# EAGLE design SparkFun_QwiicBus-Midpoint (EAGLE 9.6.0)
ABBREV: hb1; PROJECT: Heading Board
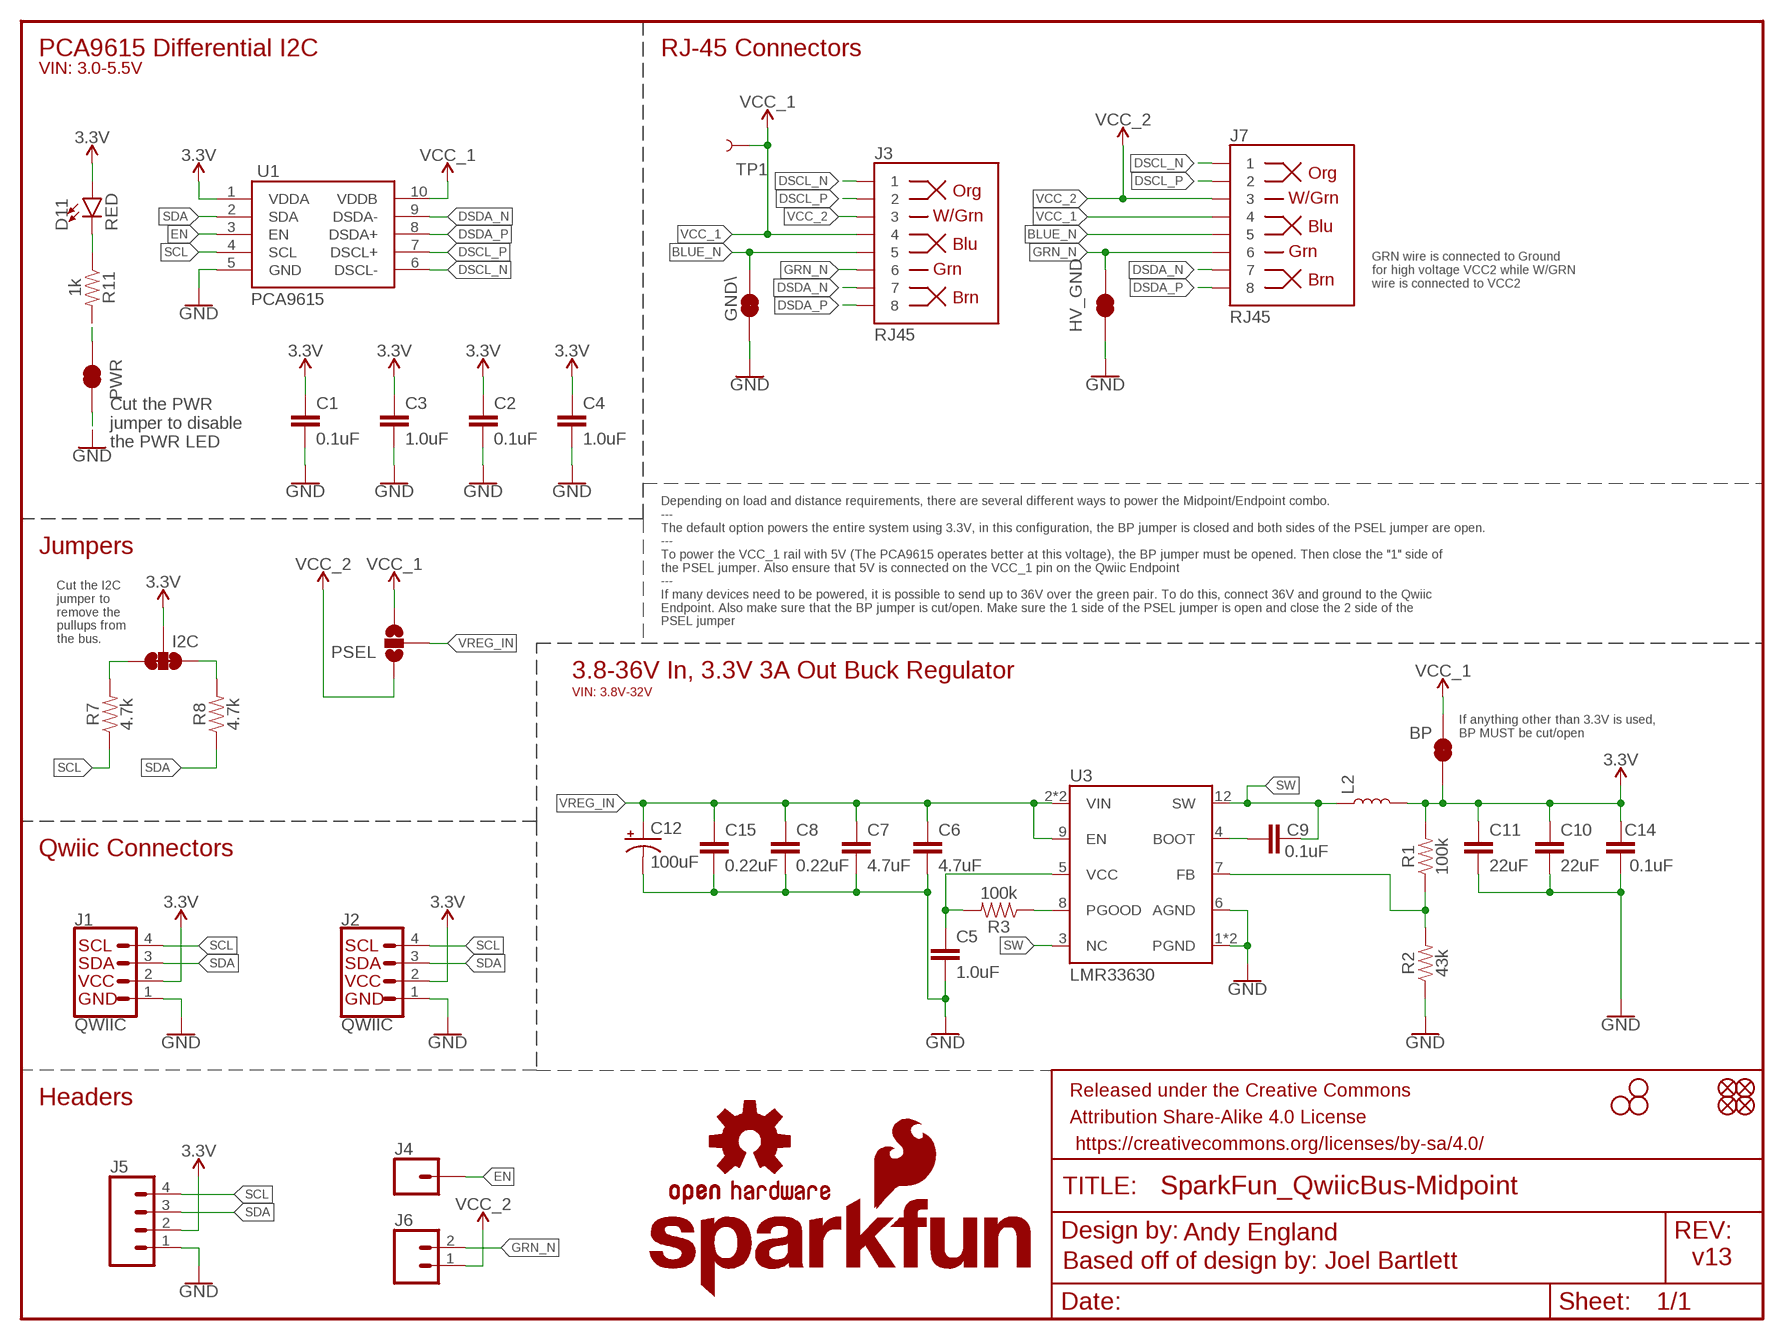
[diagram p0: schematic, sheet 1]

## Parts
BP  JUMPER-SMT_2_NC_TRACE_SILK  [SMT-JUMPER_2_NC_TRACE_SILK]
C1  0.1uF  0.1UF-0603-25V-(+80/-20%)  [0603]
C2  0.1uF  0.1UF-0603-25V-(+80/-20%)  [0603]
C3  1.0uF  1.0UF-0603-16V-10%  [0603]
C4  1.0uF  1.0UF-0603-16V-10%  [0603]
C5  1.0uF  1.0UF-0603-16V-10%  [0603]
C6  4.7uF  4.7UF-0805-50V-(10%)  [0805]
C7  4.7uF  4.7UF-0805-50V-(10%)  [0805]
C8  0.22uF  0.22UF-0603-50V-10%  [0603]
C9  0.1uF  0.1UF-0603-100V-10%  [0603]
C10  22uF  22UF-1210-16V-20%  [1210]
C11  22uF  22UF-1210-16V-20%  [1210]
C12  100uF  100UF-POLAR-8X10.5-50V  [8X10.5]
C14  0.1uF  0.1UF-0603-100V-10%  [0603]
C15  0.22uF  0.22UF-0603-50V-10%  [0603]
D11  RED  LED-RED0603  [LED-0603]
FD1  FIDUCIALUFIDUCIAL  [FIDUCIAL-MICRO]
FD2  FIDUCIALUFIDUCIAL  [FIDUCIAL-MICRO]
FD3  FIDUCIALUFIDUCIAL  [FIDUCIAL-MICRO]
FD4  FIDUCIALUFIDUCIAL  [FIDUCIAL-MICRO]
FRAME1  FRAME-LETTER  [CREATIVE_COMMONS]
GND\  JUMPER-SMT_2_NC_TRACE_SILK  [SMT-JUMPER_2_NC_TRACE_SILK]
H2  STAND-OFF  [STAND-OFF]
H3  STAND-OFF  [STAND-OFF]
H4  STAND-OFF  [STAND-OFF]
HV_GND  JUMPER-SMT_2_NC_TRACE_SILK  [SMT-JUMPER_2_NC_TRACE_SILK]
I2C  JUMPER-SMT_3_2-NC_TRACE_SILK  [SMT-JUMPER_3_2-NC_TRACE_SILK]
J1  QWIIC  QWIIC_CONNECTORJS-1MM  [JST04_1MM_RA]
J2  QWIIC  QWIIC_CONNECTORJS-1MM  [JST04_1MM_RA]
J3  RJ45  RJ45-8  [RJ45-8]
J4  CONN_01PTH_NO_SILK_YES_STOP  [1X01_NO_SILK]
J5  CONN_041X04_NO_SILK  [1X04_NO_SILK]
J6  CONN_021X02_NO_SILK  [1X02_NO_SILK]
J7  RJ45  RJ45-8  [RJ45-8]
L2  2.2uH  2.2μH_SHIELDED_INDUCTOR_5X5  [INDUCTOR_5X5MM]
LOGO1  OSHW-LOGOM  [OSHW-LOGO-M]
LOGO3  SFE_LOGO_FLAME.2_INCH  [SFE_LOGO_FLAME_.2]
LOGO4  SFE_LOGO_NAME_FLAME.1_INCH  [SFE_LOGO_NAME_FLAME_.1]
PSEL  JUMPER-SMT_3_NO_SILK  [SMT-JUMPER_3_NO_SILK]
PWR  JUMPER-SMT_2_NC_TRACE_SILK  [SMT-JUMPER_2_NC_TRACE_SILK]
R1  100k  100KOHM-0603-1/10W-1%  [0603]
R2  43k  43KOHM-0603-1/10W-1%  [0603]
R3  100k  100KOHM-0603-1/10W-1%  [0603]
R7  4.7k  4.7KOHM-0603-1/10W-1%  [0603]
R8  4.7k  4.7KOHM-0603-1/10W-1%  [0603]
R11  1k  1KOHM-0603-1/10W-1%  [0603]
TP1  TEST-POINT3  [PAD.03X.03]
U1  PCA9615  [TSSOP10]
U3  LMR33630  [VQFN-HR-12]

## Nets
3.3V: BP.1 C1.1 C2.1 C3.1 C4.1 C10.1 C11.1 C14.1 D11.A I2C.2 J1.2 J2.2 J5.2 L2.P$2 R1.2 U1.1(VDDA)
BLUE_N: GND\.2 J3.5 J7.5
DSCL_N: J3.1 J7.1 U1.6(DSCL-)
DSCL_P: J3.2 J7.2 U1.7(DSCL+)
DSDA_N: J3.7 J7.7 U1.9(DSDA-)
DSDA_P: J3.8 J7.8 U1.8(DSDA+)
EN: J4.1 U1.3(EN)
GND: C1.2 C2.2 C3.2 C4.2 C5.2 C6.2 C7.2 C8.2 C10.2 C11.2 C12.- C14.2 C15.2 GND\.1 HV_GND.1 J1.1 J2.1 J5.1 PWR.1 R2.1 U1.5(GND) U3.1(PGND) U3.6(AGND) U3.11(PGND)
GRN_N: HV_GND.2 J3.6 J6.2 J7.6
N$1: C9.1 U3.4(BOOT)
N$3: I2C.1 R8.2
N$4: I2C.3 R7.2
N$6: R1.1 R2.2 U3.7(FB)
N$7: R3.1 U3.8(PGOOD)
N$9: C5.1 R3.2 U3.5(VCC)
N$13: D11.C R11.1
N$14: PWR.2 R11.2
SCL: J1.4 J2.4 J5.4 R7.1 U1.4(SCL)
SDA: J1.3 J2.3 J5.3 R8.1 U1.2(SDA)
SW: C9.2 L2.P$1 U3.3(NC) U3.12(SW)
VCC_1: BP.2 J3.4 J7.4 PSEL.3 TP1.P$1 U1.10(VDDB)
VCC_2: J3.3 J6.1 J7.3 PSEL.1
VREG_IN: C6.1 C7.1 C8.1 C12.+ C15.1 PSEL.2 U3.2(VIN) U3.9(EN) U3.10(VIN)

## Notes on the sheet
- PCA9615 Differential I2C | RJ-45 Connectors
- VIN: 3.0-5.5V
- GRN wire is connected to Ground 
  for high voltage VCC2 while W/GRN
  wire is connected to VCC2
- Cut the PWR 
  jumper to disable
  the PWR LED
- Jumpers
- Depending on load and distance requirements, there are several different ways to power the Midpoint/Endpoint combo. 
  ---
  The default option powers the entire system using 3.3V, in this configuration, the BP jumper is closed and both sides of the PSEL jumper are open.
  ---
  To power the VCC_1 rail with 5V (The PCA9615 operates better at this voltage), the BP jumper must be opened. Then close the "1" side of 
  the PSEL jumper. Also ensure that 5V is connected on the VCC_1 pin on the Qwiic Endpoint
  ---
  If many devices need to be powered, it is possible to send up to 36V over the green pair. To do this, connect 36V and ground to the Qwiic 
  Endpoint. Also make sure that the BP jumper is cut/open. Make sure the 1 side of the PSEL jumper is open and close the 2 side of the
  PSEL jumper
- Cut the I2C 
  jumper to 
  remove the 
  pullups from 
  the bus.
- 3.8-36V In, 3.3V 3A Out Buck Regulator
- VIN: 3.8V-32V
- If anything other than 3.3V is used, 
  BP MUST be cut/open
- Qwiic Connectors
- Headers
- Andy England
- Based off of design by: Joel Bartlett | v13

## Library data of the parts
BP GND\ HV_GND PWR = SparkFun-Jumpers:JUMPER-SMT_2_NC_TRACE: Normally closed trace jumper This jumper has a trace between two pads so it's normally closed (NC). Use a razor knife to open the connection. For best results follow the IPC guidelines for cutting traces: Cutout at least 0.063 mm (0.005 in). Remove all loose material to clean up the cut area. Seal the cut with an approved epoxy. Reapply solder to reclose the connection.
C1 C2 = SparkFun-Capacitors:0.1UF: 0.1µF ceramic capacitors A capacitor is a passive two-terminal electrical component used to store electrical energy temporarily in an electric field.; PROD_ID: CAP-00810
C3-C5 = SparkFun-Capacitors:1.0UF: 1µF ceramic capacitors A capacitor is a passive two-terminal electrical component used to store electrical energy temporarily in an electric field.; PROD_ID: CAP-00868
C6 C7 = SparkFun-Capacitors:4.7UF: 4.7µF ceramic capacitors A capacitor is a passive two-terminal electrical component used to store electrical energy temporarily in an electric field.; PROD_ID: CAP-15457
C8 C15 = SparkFun-Capacitors:0.22UF: 0.22µF ceramic capacitors A capacitor is a passive two-terminal electrical component used to store electrical energy temporarily in an electric field.; PROD_ID: CAP-15456
C9 C14 = SparkFun-Capacitors:0.1UF: 0.1µF ceramic capacitors A capacitor is a passive two-terminal electrical component used to store electrical energy temporarily in an electric field.; PROD_ID: CAP-08390
C10 C11 = SparkFun-Capacitors:22UF: 22µF ceramic capacitors A capacitor is a passive two-terminal electrical component used to store electrical energy temporarily in an electric field.; PROD_ID: CAP-10381
C12 = SparkFun-Capacitors:100UF-POLAR: 100µF polarized capacitors A capacitor is a passive two-terminal electrical component used to store electrical energy temporarily in an electric field.; PROD_ID: CAP-15455
D11 = SparkFun-LED:LED-RED: Red SMD LED Used in manufacturing of most products at SparkFun Packages: 0603 - SMD 0603 package [Product Link] <http://docs.avagotech.com/docs/AV02-0551EN> 0603 SMART - SMD 0603 SMART package ( more efficient and expensive)[Product Link] <http://www.osram-os.com/Graphics/XPic2/00077099_0.pdf> 1206 - SMD1206 package [Product Link] <https://www.sparkfun.com/datasheets/DevTools/LilyPad/Q150OVS4.pdff> SparkFun Products: Pro Mini 328 -5V <https://www.sparkfun.com/products/821> RedBoard <https://www.sparkfun.com/products/12757> IOIO-OTG <https://www.sparkfun.com/products/13613>; PROD_ID: DIO-00819
FD1-FD4 = SparkFun-Aesthetics:FIDUCIAL: Fiducial Alignment Points Point-of-reference for pick-and-place machines and other optical instruments.
FRAME1 = SparkFun-Aesthetics:FRAME-LETTER: Schematic Frame - Letter Standard 8.5x11 US Letter frame
H2-H4 = SparkFun-Hardware:STAND-OFF: Stand Off Drill holes for mechanically mounting via screws, standoffs, etc. Note: Use the keepout ring to avoid running the screw head into surrounding components. Variant Overviews STAND-OFF - Mechanical footprint for a #4 phillips button head screw. STAND-OFF-TIGHT - Mechanical footprint for a #4 phillips button head screw, Example SparkFun Products Screw - Phillips Head (1/4", 4-40, 10 pack) <https://www.sparkfun.com/products/10453> (PRT-10453) Screw - Phillips Head (1/2", 4-40, 10 pack) <https://www.sparkfun.com/products/10452> (PRT-10452) Screw - Phillips Head (3/4", 4-40, 10 pack) <https://www.sparkfun.com/products/10451> (PRT-10451) Screw - Phillips Head (1", 4-40, 10 pack) <https://www.sparkfun.com/products/10450> (PRT-10450)
I2C = SparkFun-Jumpers:JUMPER-SMT_3_2-NC_TRACE: Normally closed trace jumper (2 of 2 connections) This jumper has a trace between all three pads so they are normally closed (NC). Use a razor knife to open the connection(s). For best results follow the IPC guidelines for cutting traces: Cutout at least 0.063 mm (0.005 in). Remove all loose material to clean up the cut area. Seal the cut with an approved epoxy. Reapply solder to reclose the connection(s).
J1 J2 = SparkFun-Connectors:QWIIC_CONNECTOR: SparkFun I2C Standard Qwiic Connector An SMD 1mm pitch JST connector makes it easy and quick (get it? Qwiic?) to connect I2C devices to each other. The Qwiic system <http://www.sparkfun.com/qwiic> enables fast and solderless connection between popular platforms and various sensors and actuators. We carry 200mm <https://www.sparkfun.com/products/14204>, 100mm <https://www.sparkfun.com/products/14205>, 50mm <https://www.sparkfun.com/products/14206>, and breadboard friendly <https://www.sparkfun.com/products/14207> Qwiic cables. We also offer 10 pcs strips <https://www.sparkfun.com/products/14323> the SMD connectors.; PROD_ID: CONN-13694; VALUE: QWIIC_RIGHT_ANGLE
J3 J7 = SparkFun-Connectors:RJ45-8: RJ45 Jack - 8 pin Simple RJ45, 8-pin connection. Commonly used for Cat5, Cat5e, and Cat6 Ethernet cables. Here is the connector we sell at SparkFun: RJ45 8-Pin Connector <https://www.sparkfun.com/products/643> (PRT-00643) Datasheet <https://cdn.sparkfun.com/datasheets/Prototyping/04908.pdf> It is used on this SparkFun product: SparkFun RJ45 Breakout <https://www.sparkfun.com/products/716> (BOB-00716) Note, you may also be interested in the "MAGJACK" version of this. It is basically a RJ45 connector, but also has some status LEDs built into the connector housing. You can check that out in this library at the device named "MAGJACK.dev" and see these products online: RJ45 Ethernet MagJack-Compatible <https://www.sparkfun.com/products/8534> (PRT-08534) SparkFun RJ45 MagJack Breakout <https://www.sparkfun.com/products/13021> (BOB-13021); PROD_ID: CONN-08506; SF_ID: PRT-00643
J4 = SparkFun-Connectors:CONN_01: Single connection point. Often used as Generic Header-pin footprint for 0.1 inch spaced/style header connections On any of the 0.1 inch spaced packages, you can populate with these: Break Away Headers - Straight <https://www.sparkfun.com/products/116> (PRT-00116) Break Away Male Headers - Right Angle <https://www.sparkfun.com/products/553> (PRT-00553) Female Headers <https://www.sparkfun.com/products/115> (PRT-00115) Break Away Headers - Machine Pin <https://www.sparkfun.com/products/117> (PRT-00117) Break Away Female Headers - Swiss Machine Pin <https://www.sparkfun.com/products/743> (PRT-00743) This device is also useful as a general connection point to wire up your design to another part of your project. Our various solder wires solder well into these plated through hole pads. Hook-Up Wire - Assortment (Stranded, 22 AWG) <https://www.sparkfun.com/products/11375> (PRT-11375) Hook-Up Wire - Assortment (Solid Core, 22 AWG) <https://www.sparkfun.com/products/11367> (PRT-11367) View the entire wire category on our website here <https://www.sparkfun.com/categories/141> Special notes: SMTSO-256-ET is a "flush mount" nut for a 4-40 screw. We mostly use this on specialty testbeds; it is a nice way to connect hardware to your PCB at an adjustable hieght. Also note, the SNAP packages are for using a snappable style connector. We sell a baggie of snaps and they are also used on two LilyPad designs: Snap Assortment - 30 pack (male and female) <https://www.sparkfun.com/products/11347> (DEV-11347) LilyPad Arduino SimpleSnap <https://www.sparkfun.com/products/10941> (DEV-10941) LilyPad SimpleSnap Protoboard <https://www.sparkfun.com/products/10940> (DEV-10940)
J5 = SparkFun-Connectors:CONN_04: Multi connection point. Often used as Generic Header-pin footprint for 0.1 inch spaced/style header connections On any of the 0.1 inch spaced packages, you can populate with these: Break Away Headers - Straight <https://www.sparkfun.com/products/116> (PRT-00116) Break Away Male Headers - Right Angle <https://www.sparkfun.com/products/553> (PRT-00553) Female Headers <https://www.sparkfun.com/products/115> (PRT-00115) Break Away Headers - Machine Pin <https://www.sparkfun.com/products/117> (PRT-00117) Break Away Female Headers - Swiss Machine Pin <https://www.sparkfun.com/products/743> (PRT-00743) For SCREWTERMINALS and SPRING TERMINALS visit here: Screw Terimnals on SparkFun.com <https://www.sparkfun.com/search/results?term=Screw+Terminals> (5mm/3.5mm/2.54mm spacing) This device is also useful as a general connection point to wire up your design to another part of your project. Our various solder wires solder well into these plated through hole pads. Hook-Up Wire - Assortment (Stranded, 22 AWG) <https://www.sparkfun.com/products/11375> (PRT-11375) Hook-Up Wire - Assortment (Solid Core, 22 AWG) <https://www.sparkfun.com/products/11367> (PRT-11367) View the entire wire category on our website here <https://www.sparkfun.com/categories/141> Special notes: Molex polarized connector foot print use with SKU : PRT-08231 with associated crimp pins and housings. 1MM SMD Version SKU: PRT-10208; PROD_ID: CONN-09696
J6 = SparkFun-Connectors:CONN_02: Multi connection point. Often used as Generic Header-pin footprint for 0.1 inch spaced/style header connections On any of the 0.1 inch spaced packages, you can populate with these: Break Away Headers - Straight <https://www.sparkfun.com/products/116> (PRT-00116) Break Away Male Headers - Right Angle <https://www.sparkfun.com/products/553> (PRT-00553) Female Headers <https://www.sparkfun.com/products/115> (PRT-00115) Break Away Headers - Machine Pin <https://www.sparkfun.com/products/117> (PRT-00117) Break Away Female Headers - Swiss Machine Pin <https://www.sparkfun.com/products/743> (PRT-00743) For SCREWTERMINALS and SPRING TERMINALS visit here: Screw Terimnals on SparkFun.com <https://www.sparkfun.com/search/results?term=Screw+Terminals> (5mm/3.5mm/2.54mm spacing) This device is also useful as a general connection point to wire up your design to another part of your project. Our various solder wires solder well into these plated through hole pads. Hook-Up Wire - Assortment (Stranded, 22 AWG) <https://www.sparkfun.com/products/11375> (PRT-11375) Hook-Up Wire - Assortment (Solid Core, 22 AWG) <https://www.sparkfun.com/products/11367> (PRT-11367) View the entire wire category on our website here <https://www.sparkfun.com/categories/141> Special notes: Molex polarized connector foot print use with: PRT-08233 with associated crimp pins and housings. 2.54_SCREWTERM for use with PRT-10571. 3.5mm Screw Terminal footprints for PRT-08084 5mm Screw Terminal footprints for use with PRT-08432
L2 = SparkFun-Coils:2.2μH_SHIELDED_INDUCTOR: Murata 2.2uH Inductor 2.2uH 1.2A 110mOhm 0806 Package Shielded Bourns 2.2uH Inductor 2.2uH 5.5A 205mOhm 5x5mm Package Shielded; PROD_ID: NDUC-15453
LOGO1 = SparkFun-Aesthetics:OSHW-LOGO: Open-Source Hardware (OSHW) Logo This logo indicates the piece of hardware it is found on incorporates a OSHW license and/or adheres to the definition of open source hardware found here: http://freedomdefined.org/OSHW
LOGO3 = SparkFun-Aesthetics:SFE_LOGO_FLAME: SparkFun Flame Logo This is the SparkFun flame logo. The logo on the schematic will always be the same size; the package variant is the height of the flame. Default layer for the logo on the board is tSilk.
LOGO4 = SparkFun-Aesthetics:SFE_LOGO_NAME_FLAME: SparkFun Font Logo w/ Flame This is the SparkFun full logo. The logo on the schematic will always be the same size; the package variant is the height of the flame part of the logo. Default layer for the logo on the board is tSilk.
PSEL = SparkFun-Jumpers:JUMPER-SMT_3_NO: Normally open jumper This jumper has three pads in close proximity to each other. Apply solder to close the connection(s).
R1 R3 = SparkFun-Resistors:100KOHM: 100kΩ resistor A resistor is a passive two-terminal electrical component that implements electrical resistance as a circuit element. Resistors act to reduce current flow, and, at the same time, act to lower voltage levels within circuits. - Wikipedia; PROD_ID: RES-07828
R2 = SparkFun-Resistors:43KOHM: 43kΩ resistor A resistor is a passive two-terminal electrical component that implements electrical resistance as a circuit element. Resistors act to reduce current flow, and, at the same time, act to lower voltage levels within circuits. - Wikipedia; PROD_ID: RES-07858
R7 R8 = SparkFun-Resistors:4.7KOHM: 4.7kΩ resistor A resistor is a passive two-terminal electrical component that implements electrical resistance as a circuit element. Resistors act to reduce current flow, and, at the same time, act to lower voltage levels within circuits. - Wikipedia; PROD_ID: RES-07857
R11 = SparkFun-Resistors:1KOHM: 1kΩ resistor A resistor is a passive two-terminal electrical component that implements electrical resistance as a circuit element. Resistors act to reduce current flow, and, at the same time, act to lower voltage levels within circuits. - Wikipedia; PROD_ID: RES-07856
TP1 = SparkFun-Connectors:TEST-POINT: SparkFun Test Points Bare copper test points for troubleshooting or In-Circuit-Testing. These are used by our Production team for verifying production board runs using pogo-pins on test beds. SparkFun Products: SparkFun LSM9DS1 Breakout <https://www.sparkfun.com/products/13284> SparkFun PSOC <https://www.sparkfun.com/products/13714> SparkFun Load Cell Amplifier <https://www.sparkfun.com/products/13879>
U1 = SparkFun-IC-Comms:PCA9615: Differential I2C Bus Buffer Datasheet <https://www.nxp.com/docs/en/data-sheet/PCA9615.pdf>; PROD_ID: IC-13899
U3 = SparkFun-IC-Power:LMR33630: Texas Instruments LMR33630 3.8V-36V 3A Regulator The LMR33630 SIMPLE SWITCHER® regulator is an easy-to-use, synchronous, step-down DC/DC converter that delivers best-in-class efficiency for rugged industrial applications. The LMR33630 drives up to 3 A of load current from an input of up to 36 V.; PROD_ID: VREG-15445

## Net classes
0 default: width 0.203 mm
1 power: width 0.381 mm, clearance 0.254 mm

## Board
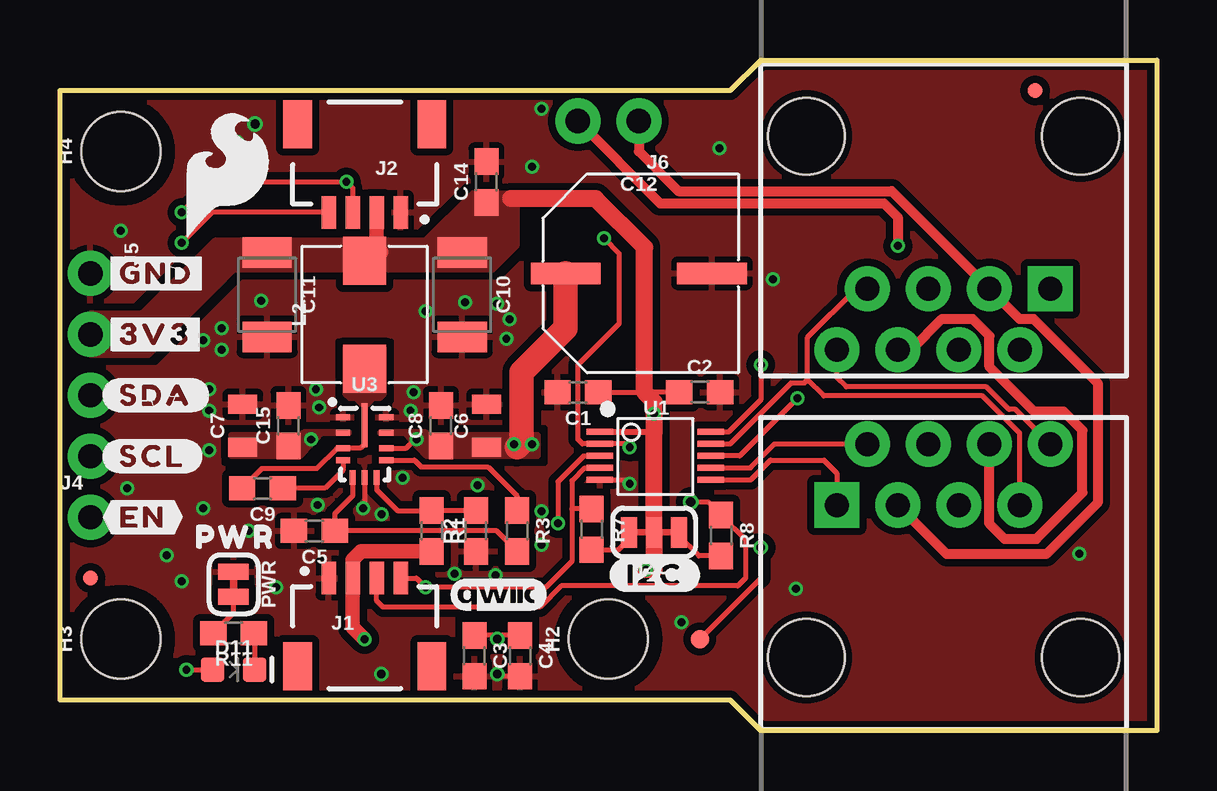
[diagram p1: board, top side]
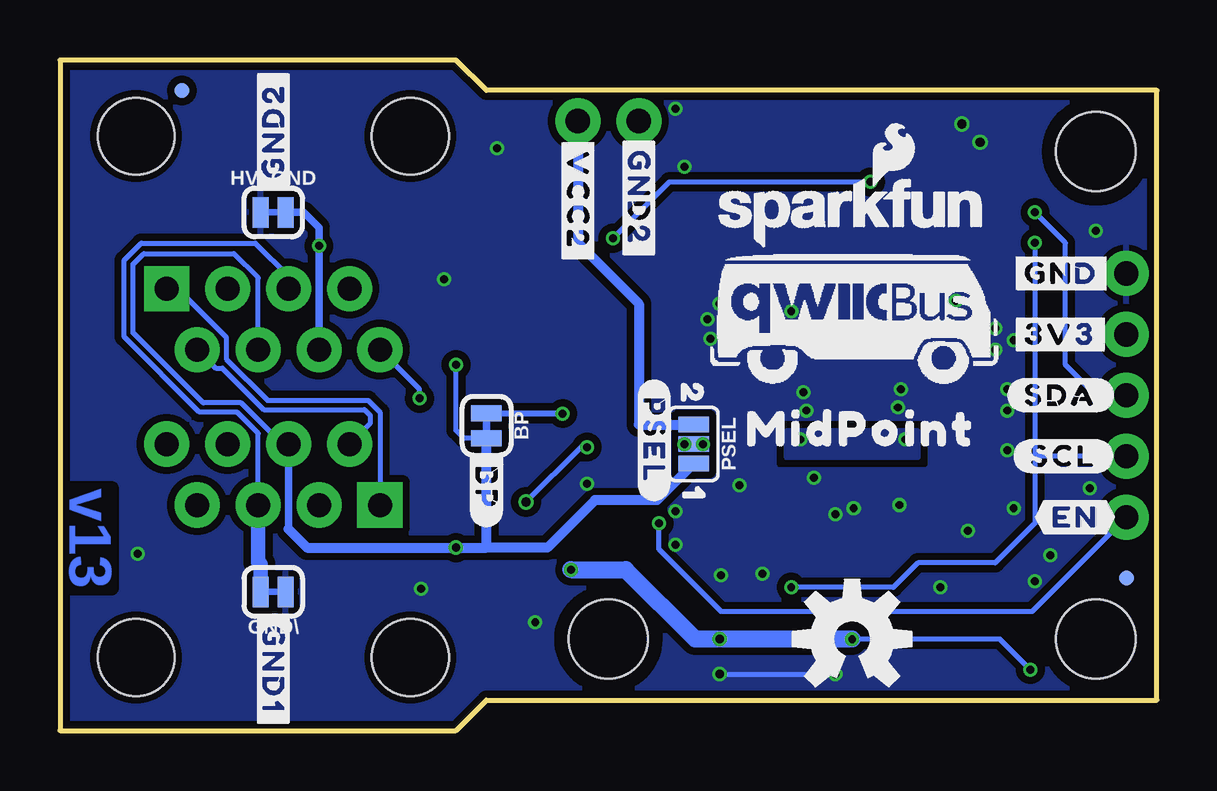
[diagram p2: board, bottom side, seen from below]

Size 45.72 x 27.94 mm. Coordinates in mm from the lower left corner, seen from the top.
Outline: 45.72,0 29.21,0 27.94,1.27 0,1.27 0,26.67 27.94,26.67 29.21,27.94 45.72,27.94 45.72,0
Copper layers (1*16): Top 0.035mm / dielectric 1.5mm / Bottom 0.035mm
Design rules "SparkFun-2-layer-FAB-LIMIT": minimum track width 4mil, minimum drill 6mil, track to track 4mil, track to pad 4mil, pad to pad 4mil, via to via 4mil, smd to smd 4mil, copper to edge 4mil, drill to drill 4mil, minimum pad ring 5mil, minimum via ring 5mil, stop-mask expansion 4mil, vias tented up to drill 25mil, thermal gap 10mil

### Footprints (pad centres in the part's own frame; a part is rotated, then mirrored left to right if it is on the bottom)
SMT-JUMPER_2_NC_TRACE_SILK = smd 0.66 x 1.27: 1 -0.521,0; 2 0.521,0
0603 = smd 1.1 x 1: 1 -0.85,0; 2 0.85,0
0805 = smd 0.8 x 1.2: 1 -0.9,0; 2 0.9,0
1210 = smd 1.27 x 2.06: 1 -1.755,0; 2 1.755,0
8X10.5 = smd 2.9 x 0.9: + -3.05,0; - 3.05,0
LED-0603 = smd 1 x 1: A -0.877,0; C 0.877,0
FIDUCIAL-MICRO = smd 0.635 x 0.635: 1 0,0
STAND-OFF = hole 3.302: 0,0
SMT-JUMPER_3_2-NC_TRACE_SILK = smd 0.66 x 1.27: 1 -1.041,0; 2 0,0; 3 1.041,0
JST04_1MM_RA = smd 0.6 x 1.35: 1 -1.5,0; 2 -0.5,0; 3 0.5,0; 4 1.5,0 | smd 1.2 x 2: NC1 2.8,-3.675; NC2 -2.8,-3.675
RJ45-8 = drill 1 pad 1.88 square: 1 -4.445,6.35 | drill 1 pad 1.88: 2 -3.175,8.89; 3 -1.905,6.35; 4 -0.635,8.89; 5 0.635,6.35; 6 1.905,8.89; 7 3.175,6.35; 8 4.445,8.89 | hole 3.2: -5.715,0; 5.715,0
1X01_NO_SILK = drill 1.016 pad 1.88: 1 0,0
1X04_NO_SILK = drill 1.016 pad 1.88: 1 0,0; 2 2.54,0; 3 5.08,0; 4 7.62,0
1X02_NO_SILK = drill 1.016 pad 1.88: 1 0,0; 2 2.54,0
INDUCTOR_5X5MM = smd 2 x 1.8: P$1 -2.25,0; P$2 2.25,0
SMT-JUMPER_3_NO_SILK = smd 0.635 x 1.27: 1 -0.813,0; 2 0,0; 3 0.813,0
PAD.03X.03 = smd 0.762 x 0.762: P$1 0,0
TSSOP10 = smd 1.1 x 0.25: 1 -2.259,1.018; 2 -2.259,0.517; 3 -2.259,0.018; 4 -2.259,-0.482; 5 -2.259,-0.988; 6 2.366,-0.988; 7 2.366,-0.482; 8 2.366,0.018; 9 2.366,0.517; 10 2.366,1.018
VQFN-HR-12 = smd 0.6 x 0.25: 1 -0.9,1.125; 2 -0.9,0.475; 3 -0.9,-0.175; 4 -0.9,-0.675; 8 0.9,-0.675; 9 0.9,-0.175; 10 0.9,0.475; 11 0.9,1.125 | smd 0.25 x 0.6: 5 -0.5,-1.4; 6 0,-1.4; 7 0.5,-1.4 | smd 0.25 x 1.824: 12 0,0.788

### Placement (x,y rotation side)
BP  27.94,12.7 270 bottom
C1  21.59,14.1 180 top
C2  26.67,14.1 0 top
C3  17.27,3.11 270 top
C4  19.18,3.11 270 top
C5  10.6,8.32 180 top
C6  17.78,12.7 90 top
C7  7.62,12.7 90 top
C8  15.88,12.7 90 top
C9  8.45,10.1 180 top
C10  16.76,18.16 270 top
C11  8.64,18.16 270 top
C12  24.13,19.05 0 top
C14  17.78,22.86 90 top
C15  9.53,12.7 90 top
D11  7.24,2.54 0 top
FD1  1.27,6.35 0 top
FD2  40.64,26.67 0 top
FD3  1.27,6.35 0 bottom
FD4  40.64,26.67 0 bottom
FRAME1  -16.51,-15.24 0 top  (outside the outline)
GND\  36.83,5.78 180 bottom
H2  22.86,3.81 90 top
H3  2.54,3.81 90 top
H4  2.54,24.13 90 top
HV_GND  36.83,21.59 0 bottom
I2C  24.77,8.26 180 top
J1  12.7,6.35 0 top
J2  12.7,21.59 180 top
J3  36.83,24.77 180 top
J4  1.27,8.89 0 top
J5  1.27,19.05 270 top
J6  24.13,25.4 180 top
J7  36.83,3.05 0 top
L2  12.7,17.34 90 top
LOGO1  12.7,3.81 0 bottom
LOGO3  6.99,23.11 0 top
LOGO4  12.7,21.59 0 bottom
PSEL  19.3,11.94 270 bottom
PWR  7.24,6.1 270 top
R1  15.49,8.32 270 top
R2  17.34,8.32 90 top
R3  19.05,8.32 270 top
R7  22.16,8.38 270 top
R8  27.56,8.13 270 top
R11  7.24,4.06 180 top
TP1  26.67,3.81 0 top
U1  24.77,11.43 0 top
U3  12.7,11.94 0 top
U$1  [#GND#0]  1.78,19.05 0 top
U$2  [#3V3#0]  1.78,16.51 0 top
U$3  [#SDA#0]  1.78,13.97 0 top
U$4  [#SCL#0]  1.78,11.43 0 top
U$5  [#BP#0]  27.94,11.75 270 bottom
U$6  [#EN#0]  1.78,8.89 0 top
U$7  [#GND#0]  6.22,19.05 0 bottom
U$8  [#3V3#0]  6.22,16.51 0 bottom
U$9  [#SDA#0]  6.22,13.97 0 bottom
U$10  [#SCL#0]  5.97,11.43 0 bottom
U$11  [#GND2#0]  36.83,22.29 90 bottom
U$12  [#EN#0]  5.08,8.89 0 bottom
U$13  [#I2C#0]  22.92,6.48 0 top
U$14  [#GND1#0]  36.83,5.08 270 bottom
U$15  [QWIICBUS#WORKING#LOGO#JPG]  12.19,17.53 0 bottom
U$16  [#VCC2#0]  24.13,24.83 270 bottom
U$17  [#PSEL#0]  20.95,14.61 270 bottom
U$18  [10]  19.3,10.86 270 bottom
U$19  [20]  19.37,15.18 270 bottom
U$20  [ORDERING_INSTRUCTIONS]  53.34,43.18 0 top  (outside the outline)
U$22  [QWIIC_4MM]  18.29,5.65 0 top
U$23  [PWR0]  4.95,8.06 0 top
U$24  [#GND2#0]  21.59,24.89 270 bottom
U$30  [MIDPOINT0]  18.16,12.57 0 bottom

### Tracks (layer width: path | path; a pad name or v marks a point on that pad's centre or on a via)
3.3V  (via drill 0.33, 0.35)
  Top 0.203: v5.27,2.54 D11.A | 24.76,12.45 24.77,12.45 | C4.1 18.07,3.96 | 18.07,3.96 C3.1 | 18.07,3.96 v18.22,3.81 | C2.1 24.36,14.1 C1.1
  Top 0.254: U1.1 24.76,12.45
  Top 0.61: v12.7,3.81 12.2,4.31 J1.2 12.2,7.12 12.55,7.47 R1.2 | J2.2 13.2,20.07
  Top 0.711: 13.2,20.07 13.34,19.94 | v24.42,6.71 24.77,6.71 I2C.2 24.77,12.45 v24.77,13.21 24.77,13.7 24.36,14.1 24.36,20.13 22.33,22.16 18.8,22.16 | v24.42,6.71
  Bottom 0.203: v5.27,2.54 6.54,3.81 v12.7,3.81 | v24.78,13.22 v24.77,13.21
  Bottom 0.254: BP.1 v24.78,13.22
  Bottom 0.711: v24.42,6.71 22.14,6.71 19.24,3.81 v18.22,3.81 v12.7,3.81
  pour Top (no thermals): 1.27,17.4 3.43,17.4 6.48,20.45 15.24,20.45 17.21,22.42 19.05,22.42 19.05,20.19 18.03,19.18 7.24,19.18 3.68,15.62 1.27,15.62
BLUE_N
  Bottom 0.203: J7.5 37.45,12.38 38.34,13.27 39.91,13.27 43.05,16.42 43.05,19.59 42.34,20.31 37.58,20.31 36.2,18.92 J3.5
  Bottom 0.61: J7.5 37.45,7.02 37.35,6.92 GND\.2
DSCL_N
  Top 0.203: J7.1 32.38,10.73 31.85,11.26 29.62,11.26 28.8,10.44 U1.6
  Bottom 0.203: J7.1 32.38,13.27 32.87,13.76 37.07,13.76 38.79,15.47 38.79,16.38 40.82,18.41 J3.1
DSCL_P
  Top 0.203: J7.2 29.77,11.94 28.78,10.95 U1.7
  Bottom 0.203: J7.2 32.79,12.81 32.79,13.13 33.03,13.38 37.23,13.38 38.95,15.1 39.23,15.1 J3.2
DSDA_N
  Top 0.203: J3.7 33.2,18.41 31.17,16.38 31.17,14.62 | 31.17,14.62 31.84,13.94 38.45,13.94 40.01,12.39 J7.7 | U1.9 27.94,11.95 30.48,14.49 31.04,14.49 31.17,14.62
DSDA_P  (via drill 0.33)
  Top 0.203: J3.8 32.38,14.71 32.77,14.32 38.61,14.32 39.56,13.38 39.83,13.38 J7.8 | v30.73,13.84 28.34,11.45 U1.8
  Bottom 0.203: v30.73,13.84 30.73,14.22 J3.8
EN  (via drill 0.33)
  Top 0.203: U1.3 22.49,11.43 21.81,11.43 20.75,10.37 v20.75,8.64
  Bottom 0.203: J4.1 5.21,4.95 18.15,4.95 20.75,7.56 v20.75,8.64
GND  (via drill 0.33, 0.35, 0.38)
  Top 0.203: U1.5 23.59,10.44 v23.75,10.29 | U3.6 12.7,9.14 | C4.2 18.38,2.26 18.29,2.35 v18.22,2.35
  Bottom 0.203: v18.22,2.35 v13.4,2.35
  other vias: 25.91,4.51 16.45,6.54 18.16,6.48 9.02,5.97 29.72,18.8 30.67,5.91 42.48,7.37 27.5,24.26 20.07,25.91 7.37,24.51 8.13,25.27 2.54,20.83 19.68,23.5 6.22,11.68 5.97,9.27 2.79,10.1 5.08,6.22 6.22,13.34 6.22,14.22 6.73,15.88 6.73,16.76 5.97,16.26 10.67,14.22 10.79,13.46 14.61,13.34 14.73,14.1 18.22,17.78 15.24,17.46 18.73,17.14 18.61,16.32 12.64,9.27 13.4,9.02 4.45,7.3 7.87,8.32 10.73,9.4 14.29,10.54 17.4,10.22 20.07,9.14 20.07,7.75 16.89,17.84 8.38,17.91
  pour Top (isolate 0.305, rank 2): 45.72,0 29.21,0 27.94,1.27 0,1.27 0,26.67 27.94,26.67 29.21,27.94 45.72,27.94
  pour Bottom (isolate 0.305, rank 2): 45.72,0 29.21,0 27.94,1.27 0,1.27 0,26.67 27.94,26.67 29.21,27.94 45.72,27.94
GRN_N  (via drill 0.33)
  Top 0.406: J3.6 35.49,15.88 36.77,17.16 38.03,17.16 38.75,16.44 38.75,15.15 40.62,13.28 41.84,13.28 42.62,12.51 42.62,9.91 40.7,7.99 39.37,7.99 38.72,8.64 38.72,11.93 J7.6 | J6.2 25.02,21.97 34.35,21.97 34.92,21.4 v34.92,20.19
  Bottom 0.305: J3.6 v34.92,20.19 34.92,20.95 35.56,21.59 HV_GND.2
N$1
  Top 0.203: U3.4 11.8,10.85 11.05,10.1 C9.1
N$3
  Top 0.203: R8.2 26.63,7.28 25.81,8.1 I2C.1
N$4
  Top 0.203: R7.2 23.28,7.53 23.72,7.98 I2C.3
N$6
  Top 0.203: 16.99,9.17 R2.2 R1.1 14.07,9.17 13.21,10.03 U3.7
N$7
  Top 0.203: U3.8 14.77,11.26 15.05,10.99 17.84,10.99 19.05,9.78 R3.1
N$9
  Top 0.203: 12.2,10.42 U3.5 12.2,9.79 11.45,9.04 C5.1 18.2,8.32 R3.2
N$13
  Top 0.203: R11.1 8.12,4.04 D11.C
N$14
  Top 0.203: R11.2 7.24,4.91 PWR.2
SCL  (via drill 0.33)
  Top 0.203: J1.4 14.86,6.35 v15.24,5.97 20.26,5.97 21.34,7.05 21.34,9.23 | U1.4 21.87,10.95 21.34,10.41 21.34,9.23 | R7.1 21.34,9.23 | J2.4 6.35,21.59 v5.08,20.32
  Bottom 0.203: v15.24,5.97 10.99,5.97 9.97,6.99 6.73,6.99 5.08,8.64 5.08,11.43 | v5.08,20.32 5.08,11.43 | J5.4 5.08,11.43
SDA  (via drill 0.33, 0.38)
  Top 0.203: J1.3 13.2,5.41 13.46,5.14 20,5.14 20.89,6.03 28.26,6.03 28.57,6.35 28.57,7.96 R8.1 27.01,9.53 v26.29,9.53 | v23.75,11.81 23.61,11.95 U1.2 21.77,11.95 21.59,12.13 21.59,15.24 23.3,16.95 23.3,19.88 v22.67,20.51 | v5.08,21.59 6.35,22.86 v11.94,22.86 12.2,22.6 J2.3
  Bottom 0.203: v26.29,9.53 24,11.81 v23.75,11.81 | J5.3 2.54,13.97 3.81,15.24 3.81,20.32 v5.08,21.59 | v22.67,20.51 20.32,22.86 v11.94,22.86
SW
  Top 0.203: U3.12 12.7,11.94 12.53,11.76 U3.3 11.55,11.76 10.71,10.92 8.42,10.92 C9.2
  pour Top (no thermals): 11.87,15.94 11.87,14.03 12.06,13.84 12.32,13.84 12.57,13.59 12.83,13.59 13.08,13.84 13.34,13.84 13.53,14.03 13.53,15.94
VCC_1  (via drill 0.33, 0.35)
  Top 0.203: v29.21,15.24 29.21,13.78 27.88,12.45 U1.10 | v29.21,7.62 29.21,6.35 TP1.P$1
  Bottom 0.203: J7.4 36.45,11.94 38.16,13.65 39.75,13.65 42.67,16.57 42.67,19.43 42.23,19.88 38.47,19.88 37.47,18.87 | 37.47,18.87 37.45,18.86 | BP.2 28.88,12.18 29.21,12.51 v29.21,15.24 | J3.4 37.47,18.87
  Bottom 0.305: J7.4 36.2,8.39
  Bottom 0.406: 36.2,8.39 35.42,7.62 v29.21,7.62 27.94,7.62 | PSEL.3 20.83,9.6 23.42,9.6 25.4,7.62 27.94,7.62 | 27.94,7.62 BP.2
VCC_2
  Top 0.203: 38.73,18.46 J3.3
  Top 0.406: J6.1 24.13,24.13 25.78,22.48 34.67,22.48 J3.3 39.99,17.16 40.57,17.16 43.26,14.47 43.26,9.5 41.11,7.35 36.96,7.35 34.92,9.39 J7.3
  Bottom 0.406: J6.1 24.13,20.32 21.59,17.78 21.59,12.75 PSEL.1
VREG_IN  (via drill 0.33)
  Top 0.203: U3.9 14.43,11.76 14.86,12.19 | v18.92,11.94 19.05,11.81 19.05,11.68
  Top 1.016: C12.+ 21.08,16.76 19.24,14.92 19.24,12 19.05,11.81
  Bottom 0.203: PSEL.2 v18.92,11.94
  other vias: 19.68,11.94 14.86,12.13 10.48,12.13
  pour Top (no thermals): 13.34,12.38 14.35,12.38 15.24,11.43 19.94,11.43 19.94,12.32 15.37,12.32 15.24,12.45 13.34,12.45
  pour Top (no thermals): 12.06,12.45 10.16,12.45 10.03,12.32 7.11,12.32 7.11,11.43 10.03,11.43 10.16,11.56 10.92,12.38 12.06,12.38
  pour Bottom (isolate 0.305): 9.97,12.51 9.97,11.37 15.43,11.37 15.43,12.51

### Text on the board
Bottom: v13
Measures: Units in Inches
tDocu: 2 Oz Copper | Andy England | Based on a design by: Joel Bartlett